# Altium schematic sheet 1gb_switch.SchDoc
size 594 x 420 mm; Address1: Address1; Address2: Address2; Address3: Address3; Address4: Address4; DocumentNumber: 3; SheetNumber: 3; SheetTotal: 6; Перв_применение: Э3
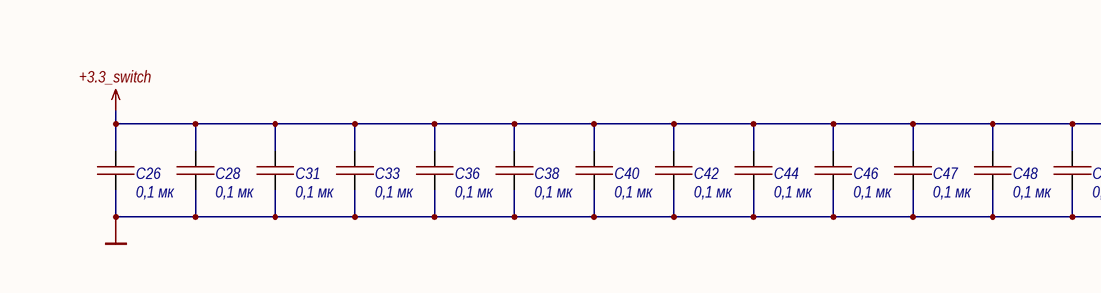
[diagram p0: 1gb_switch.SchDoc, top left]
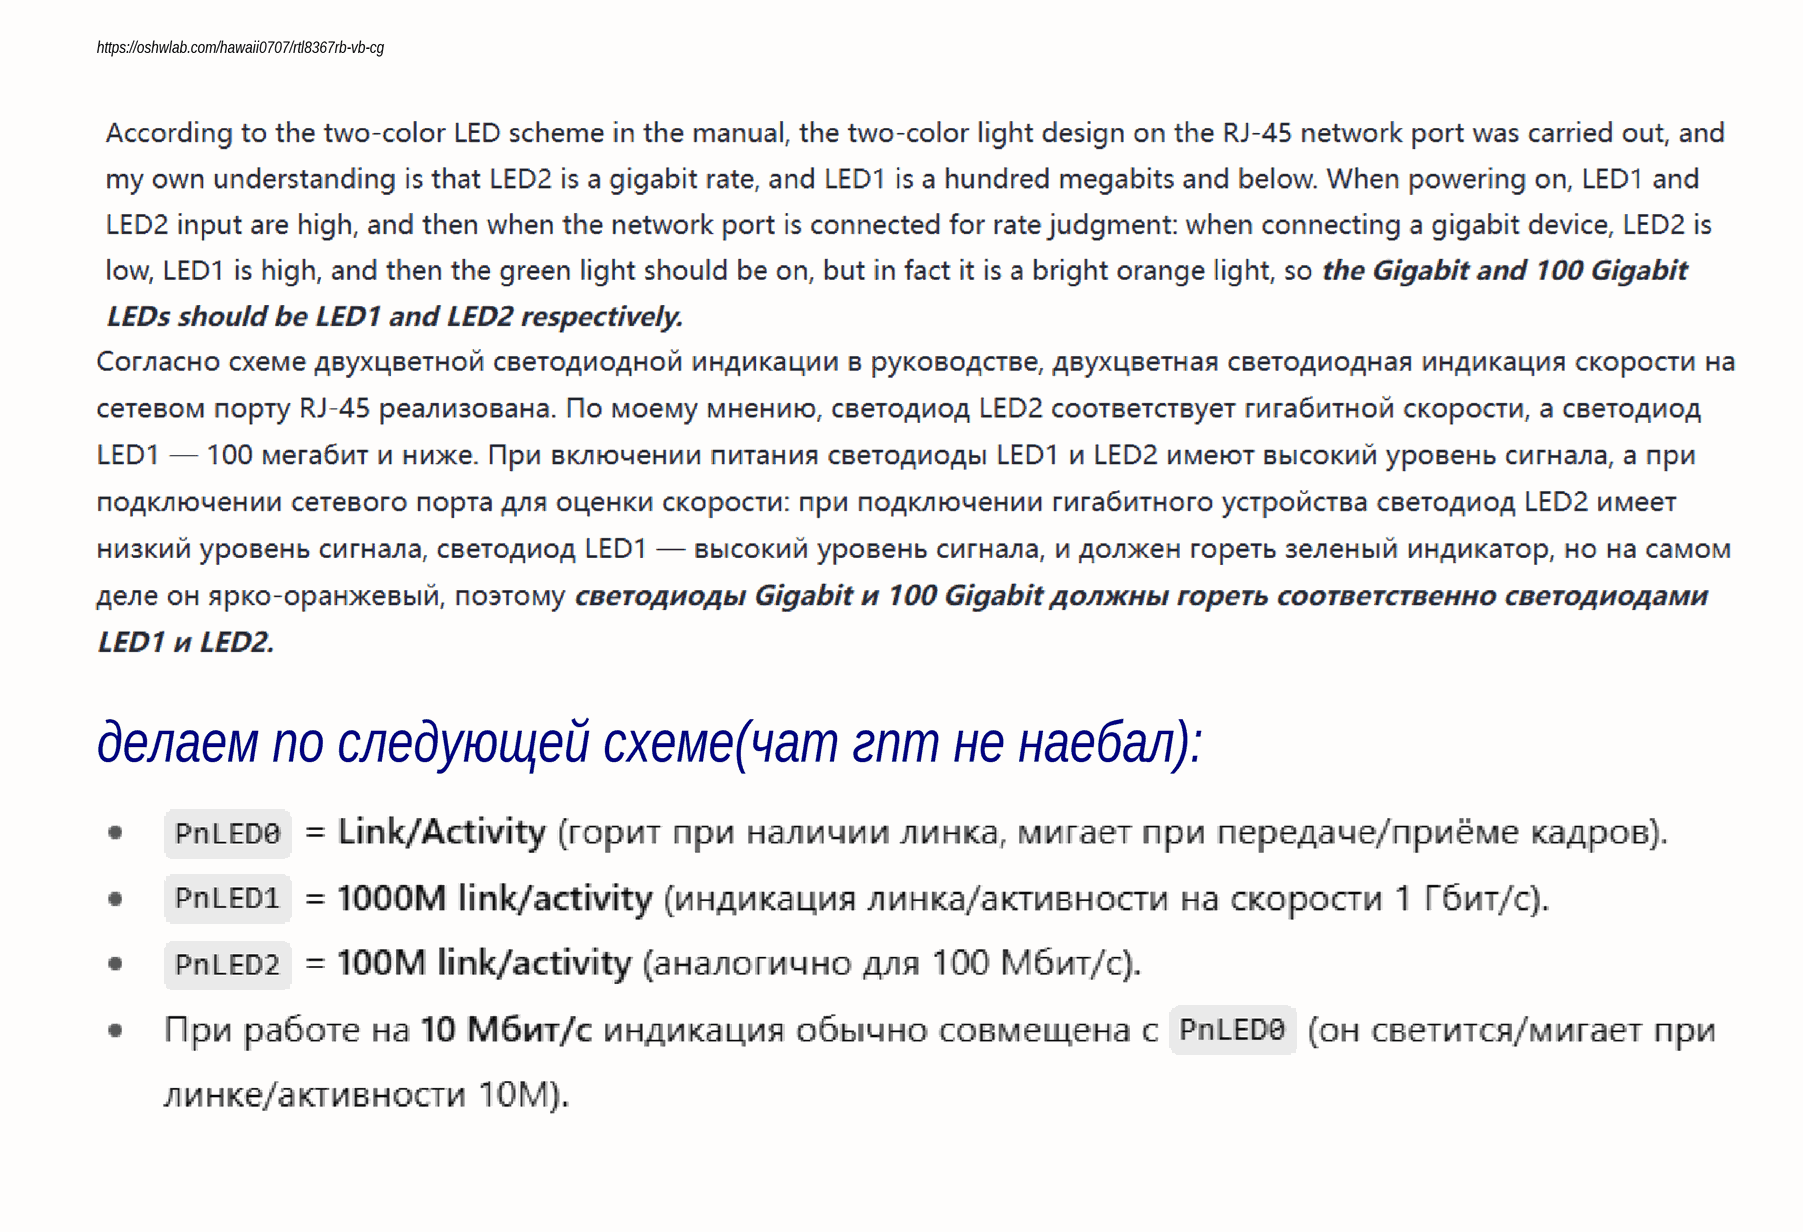
[diagram p1: 1gb_switch.SchDoc, top right]
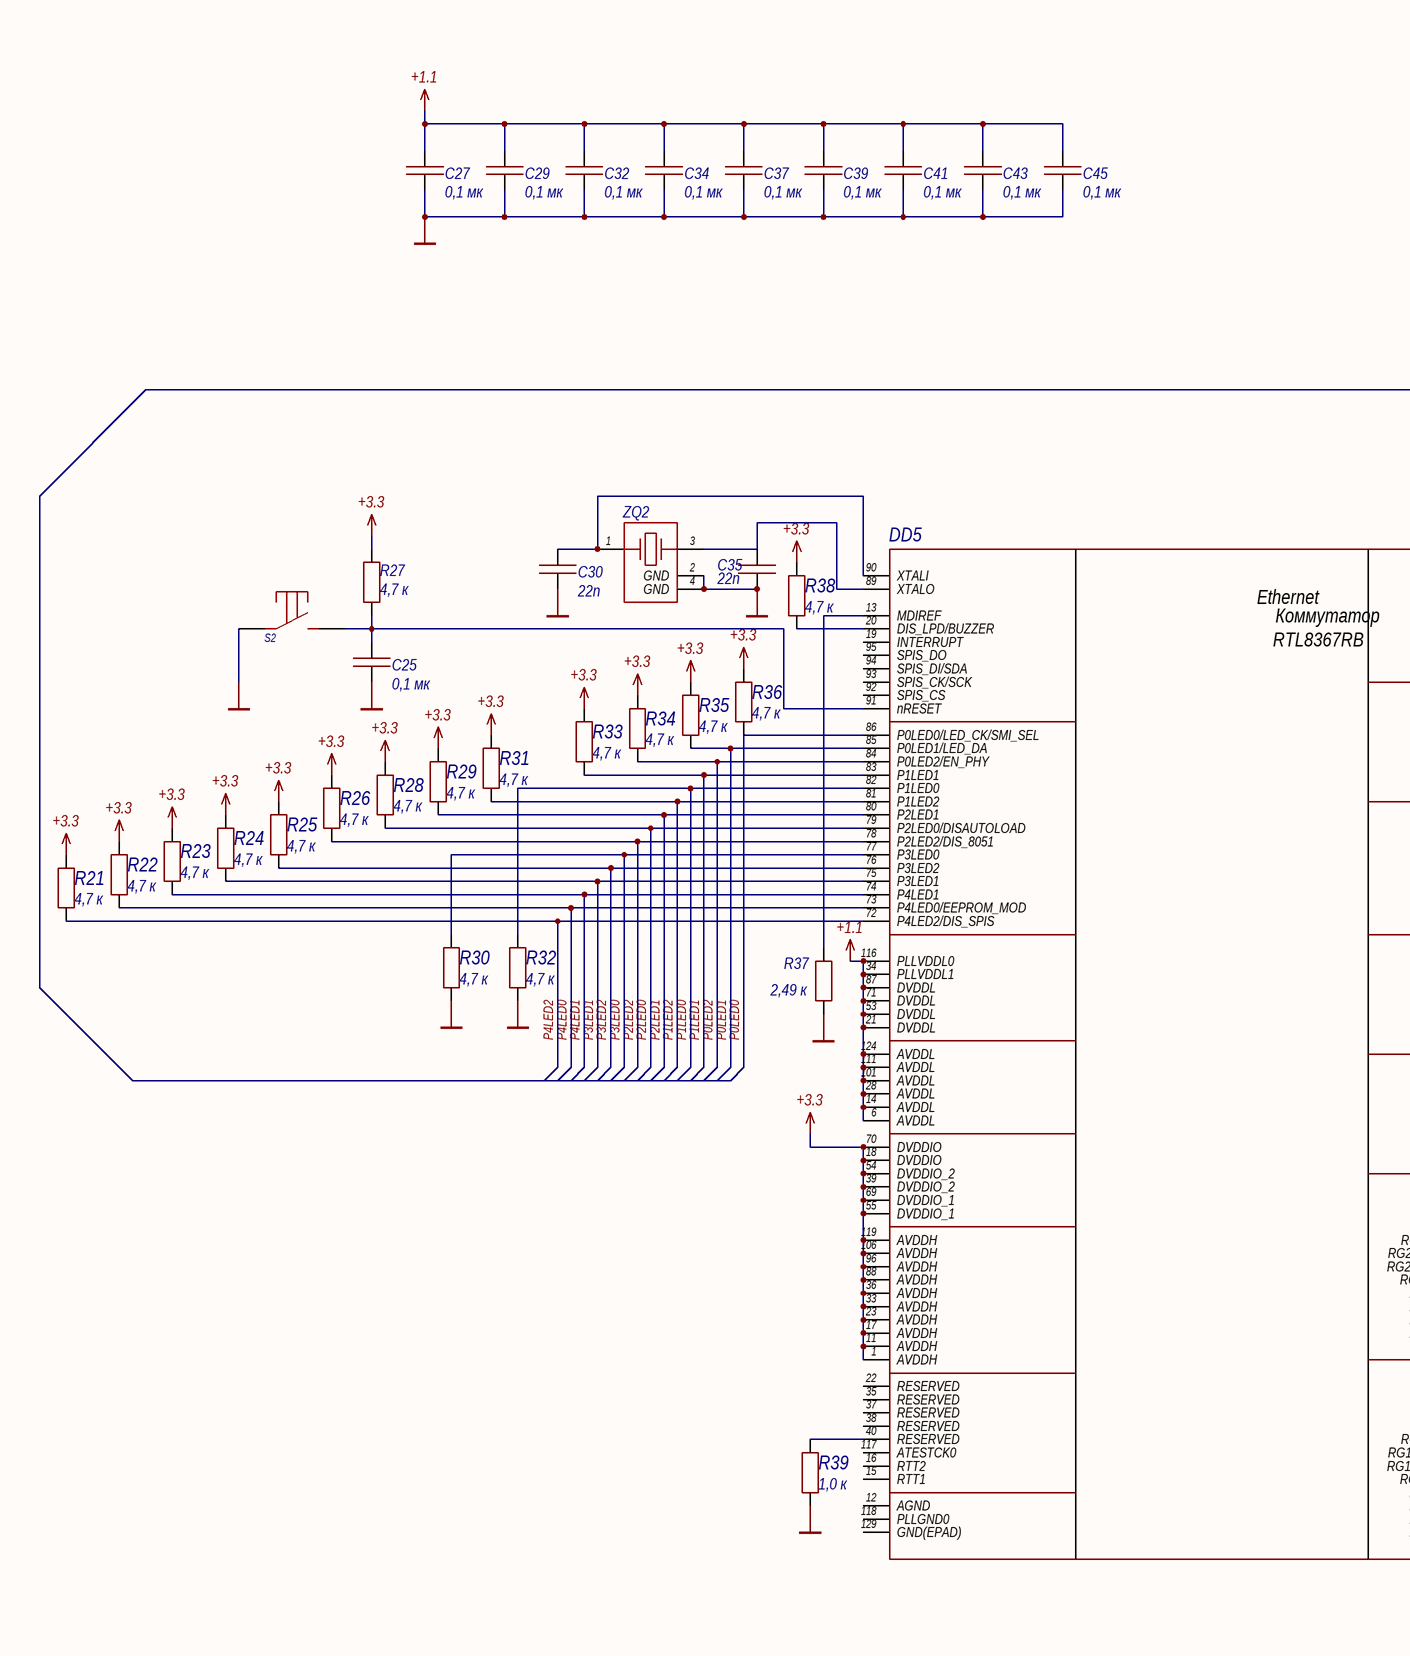
[diagram p2: 1gb_switch.SchDoc, bottom left]
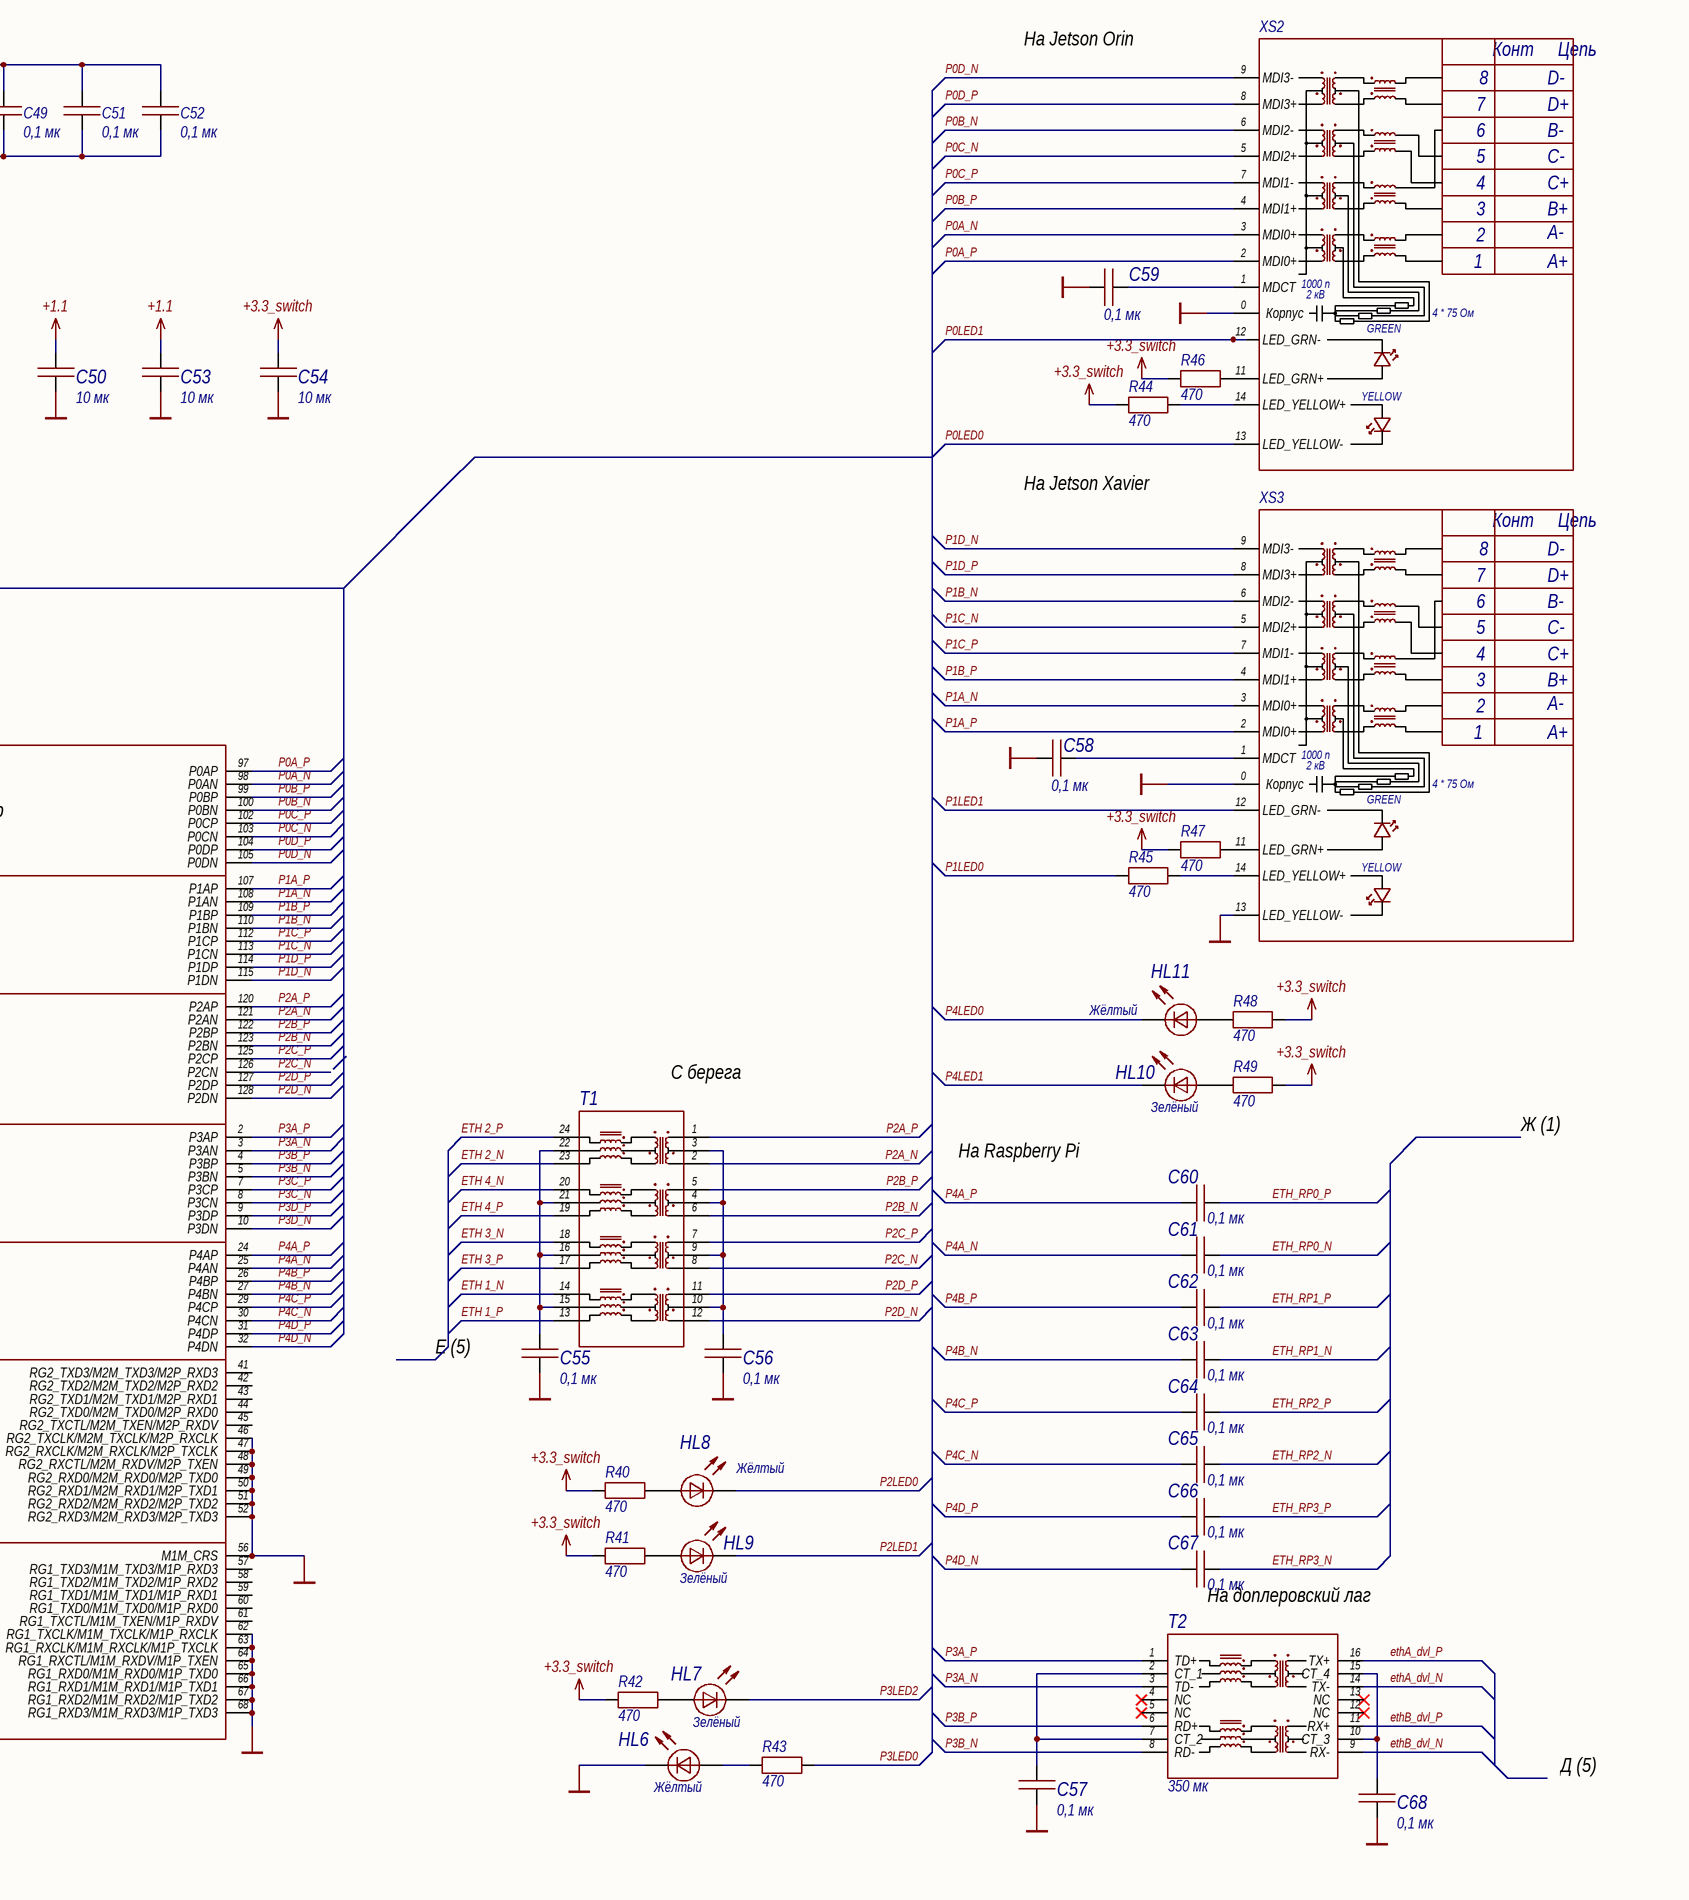
[diagram p3: 1gb_switch.SchDoc, bottom right]

## Parts
C25  value 0,1 мк  [0603C]  (hidden comment: Capacitor)
C26  value 0,1 мк  [0402C]  (hidden comment: Capacitor)
C27  value 0,1 мк  [0402C]  (hidden comment: Capacitor)
C28  value 0,1 мк  [0402C]  (hidden comment: Capacitor)
C29  value 0,1 мк  [0402C]  (hidden comment: Capacitor)
C30  value 22п  [0603C]  (hidden comment: GRM1885C1H220J)
C31  value 0,1 мк  [0402C]  (hidden comment: Capacitor)
C32  value 0,1 мк  [0402C]  (hidden comment: Capacitor)
C33  value 0,1 мк  [0402C]  (hidden comment: Capacitor)
C34  value 0,1 мк  [0402C]  (hidden comment: Capacitor)
C35  value 22п  [0603C]  (hidden comment: GRM1885C1H220J)
C36  value 0,1 мк  [0402C]  (hidden comment: Capacitor)
C37  value 0,1 мк  [0402C]  (hidden comment: Capacitor)
C38  value 0,1 мк  [0402C]  (hidden comment: Capacitor)
C39  value 0,1 мк  [0402C]  (hidden comment: Capacitor)
C40  value 0,1 мк  [0402C]  (hidden comment: Capacitor)
C41  value 0,1 мк  [0402C]  (hidden comment: Capacitor)
C42  value 0,1 мк  [0402C]  (hidden comment: Capacitor)
C43  value 0,1 мк  [0402C]  (hidden comment: Capacitor)
C44  value 0,1 мк  [0402C]  (hidden comment: Capacitor)
C45  value 0,1 мк  [0402C]  (hidden comment: Capacitor)
C46  value 0,1 мк  [0402C]  (hidden comment: Capacitor)
C47  value 0,1 мк  [0402C]  (hidden comment: Capacitor)
C48  value 0,1 мк  [0402C]  (hidden comment: Capacitor)
C49  value 0,1 мк  [0402C]  (hidden comment: Capacitor)
C50  value 10 мк  [1210C]  (hidden comment: Capacitor)
C51  value 0,1 мк  [0402C]  (hidden comment: Capacitor)
C52  value 0,1 мк  [0402C]  (hidden comment: Capacitor)
C53  value 10 мк  [1210C]  (hidden comment: Capacitor)
C54  value 10 мк  [1210C]  (hidden comment: Capacitor)
C55  value 0,1 мк  [0603C]  (hidden comment: Capacitor)
C56  value 0,1 мк  [0603C]  (hidden comment: Capacitor)
C57  value 0,1 мк  [0603C]  (hidden comment: Capacitor)
C58  value 0,1 мк  [0603C]  (hidden comment: Capacitor)
C59  value 0,1 мк  [0603C]  (hidden comment: Capacitor)
C60  value 0,1 мк  [0402C]  (hidden comment: Capacitor)
C61  value 0,1 мк  [0402C]  (hidden comment: Capacitor)
C62  value 0,1 мк  [0402C]  (hidden comment: Capacitor)
C63  value 0,1 мк  [0402C]  (hidden comment: Capacitor)
C64  value 0,1 мк  [0402C]  (hidden comment: Capacitor)
C65  value 0,1 мк  [0402C]  (hidden comment: Capacitor)
C66  value 0,1 мк  [0402C]  (hidden comment: Capacitor)
C67  value 0,1 мк  [0402C]  (hidden comment: Capacitor)
C68  value 0,1 мк  [0603C]  (hidden comment: Capacitor)
DD5  RTL8367RB-VB  [LQFP128_14x14_exposed_pad]  (value not drawn)
HL6  value Жёлтый  [0603D_yellow]  (hidden comment: LED 0603 YELLOW)
HL7  value Зелёный  [0603D_green]  (hidden comment: LED 0603 GREEN)
HL8  value Жёлтый  [0603D_yellow]  (hidden comment: LED 0603 YELLOW)
HL9  value Зелёный  [0603D_green]  (hidden comment: LED 0603 GREEN)
HL10  value Зелёный  [0603D_green]  (hidden comment: LED 0603 GREEN)
HL11  value Жёлтый  [0603D_yellow]  (hidden comment: LED 0603 YELLOW)
R21  value 4,7 к  [0402R]  (hidden comment: Resistor)
R22  value 4,7 к  [0402R]  (hidden comment: Resistor)
R23  value 4,7 к  [0402R]  (hidden comment: Resistor)
R24  value 4,7 к  [0402R]  (hidden comment: Resistor)
R25  value 4,7 к  [0402R]  (hidden comment: Resistor)
R26  value 4,7 к  [0402R]  (hidden comment: Resistor)
R27  value 4,7 к  [0402R]  (hidden comment: Resistor)
R28  value 4,7 к  [0402R]  (hidden comment: Resistor)
R29  value 4,7 к  [0402R]  (hidden comment: Resistor)
R30  value 4,7 к  [0402R]  (hidden comment: Resistor)
R31  value 4,7 к  [0402R]  (hidden comment: Resistor)
R32  value 4,7 к  [0402R]  (hidden comment: Resistor)
R33  value 4,7 к  [0402R]  (hidden comment: Resistor)
R34  value 4,7 к  [0402R]  (hidden comment: Resistor)
R35  value 4,7 к  [0402R]  (hidden comment: Resistor)
R36  value 4,7 к  [0402R]  (hidden comment: Resistor)
R37  value 2,49 к  [0603R]  (hidden comment: RC0603FR-072K49L)
R38  value 4,7 к  [0402R]  (hidden comment: Resistor)
R39  value 1,0 к  [0402R]  (hidden comment: Resistor)
R40  value 470  [0402R]  (hidden comment: Resistor)
R41  value 470  [0402R]  (hidden comment: Resistor)
R42  value 470  [0402R]  (hidden comment: Resistor)
R43  value 470  [0402R]  (hidden comment: Resistor)
R44  value 470  [0402R]  (hidden comment: Resistor)
R45  value 470  [0402R]  (hidden comment: Resistor)
R46  value 470  [0402R]  (hidden comment: Resistor)
R47  value 470  [0402R]  (hidden comment: Resistor)
R48  value 470  [0402R]  (hidden comment: Resistor)
R49  value 470  [0402R]  (hidden comment: Resistor)
S2  TSS-TD-19XA-XTR  [TSS-TD-19XA-XTR]  (value not drawn)
T1  H5120NLT  [H5120NLT]  (value not drawn)
T2  value 350 мк  [B78476A8065A003]  (hidden comment: B78476A8065A003)
XS2  HR911130A  [HR911130A]  (value not drawn)
XS3  HR911130A  [HR911130A]  (value not drawn)
ZQ2  X322525MOB4SI  [X322525MOB4SI]  (value not drawn)

## Nets
+1.1: C27.2 C29.2 C32.2 C34.2 C37.2 C39.2 C41.2 C43.2 C45.2 C50.2 C53.2 DD5.6(AVDDL) DD5.14(AVDDL) DD5.21(DVDDL) DD5.28(AVDDL) DD5.34(PLLVDDL1) DD5.53(DVDDL) DD5.71(DVDDL) DD5.87(DVDDL) DD5.101(AVDDL) DD5.111(AVDDL) DD5.116(PLLVDDL0) DD5.124(AVDDL)
+3.3: DD5.1(AVDDH) DD5.11(AVDDH) DD5.17(AVDDH) DD5.18(DVDDIO) DD5.23(AVDDH) DD5.33(AVDDH) DD5.36(AVDDH) DD5.39(DVDDIO_2) DD5.54(DVDDIO_2) DD5.55(DVDDIO_1) DD5.69(DVDDIO_1) DD5.70(DVDDIO) DD5.88(AVDDH) DD5.96(AVDDH) DD5.106(AVDDH) DD5.119(AVDDH) R21.2 R22.2 R23.2 R24.2 R25.2 R26.2 R27.2 R28.2 R29.2 R31.2 R33.2 R34.2 R35.2 R36.2 R38.2
+3.3_switch: C26.2 C28.2 C31.2 C33.2 C36.2 C38.2 C40.2 C42.2 C44.2 C46.2 C47.2 C48.2 C49.2 C51.2 C52.2 C54.2 R40.1 R41.1 R42.1 R44.1 R46.1 R47.1 R48.1 R49.1
GND: C25.1 C26.1 C27.1 C28.1 C29.1 C30.1 C31.1 C32.1 C33.1 C34.1 C35.2 C36.1 C37.1 C38.1 C39.1 C40.1 C41.1 C42.1 C43.1 C44.1 C45.1 C46.1 C47.1 C48.1 C49.1 C50.1 C51.1 C52.1 C53.1 C54.1 C55.1 C56.1 C57.1 C58.1 C59.1 C68.1 DD5.46(RG2_TXCLK/M2M_TXCLK/M2P_RXCLK) DD5.47(RG2_RXCLK/M2M_RXCLK/M2P_TXCLK) DD5.48(RG2_RXCTL/M2M_RXDV/M2P_TXEN) DD5.49(RG2_RXD0/M2M_RXD0/M2P_TXD0) DD5.50(RG2_RXD1/M2M_RXD1/M2P_TXD1) DD5.51(RG2_RXD2/M2M_RXD2/M2P_TXD2) DD5.52(RG2_RXD3/M2M_RXD3/M2P_TXD3) DD5.56(M1M_CRS) DD5.62(RG1_TXCLK/M1M_TXCLK/M1P_RXCLK) DD5.63(RG1_RXCLK/M1M_RXCLK/M1P_TXCLK) DD5.64(RG1_RXCTL/M1M_RXDV/M1P_TXEN) DD5.65(RG1_RXD0/M1M_RXD0/M1P_TXD0) DD5.66(RG1_RXD1/M1M_RXD1/M1P_TXD1) DD5.67(RG1_RXD2/M1M_RXD2/M1P_TXD2) DD5.68(RG1_RXD3/M1M_RXD3/M1P_TXD3) HL6.2 R30.1 R32.1 R37.1 R39.1 S2.1 XS2.0(Корпус) XS3.0(Корпус) XS3.13(LED_YELLOW-) ZQ2.2(GND) ZQ2.4(GND)
ETH 1_N: T1.14
ETH 1_P: T1.13
ETH 2_N: T1.23
ETH 2_P: T1.24
ETH 3_N: T1.18
ETH 3_P: T1.17
ETH 4_N: T1.20
ETH 4_P: T1.19
ETH_RP0_N: C61.2
ETH_RP0_P: C60.2
ETH_RP1_N: C63.2
ETH_RP1_P: C62.2
ETH_RP2_N: C65.2
ETH_RP2_P: C64.2
ETH_RP3_N: C67.2
ETH_RP3_P: C66.2
ethA_dvl_N: T2.14(TX-)
ethA_dvl_P: T2.16(TX+)
ethB_dvl_N: T2.9(RX-)
ethB_dvl_P: T2.11(RX+)
P0A_N: DD5.98(P0AN) XS2.3(MDI0+)
P0A_P: DD5.97(P0AP) XS2.2(MDI0+)
P0B_N: DD5.100(P0BN) XS2.6(MDI2-)
P0B_P: DD5.99(P0BP) XS2.4(MDI1+)
P0C_N: DD5.103(P0CN) XS2.5(MDI2+)
P0C_P: DD5.102(P0CP) XS2.7(MDI1-)
P0D_N: DD5.105(P0DN) XS2.9(MDI3-)
P0D_P: DD5.104(P0DP) XS2.8(MDI3+)
P0LED0: DD5.86(P0LED0/LED_CK/SMI_SEL) R36.1 XS2.13(LED_YELLOW-)
P0LED1: DD5.85(P0LED1/LED_DA) R35.1 XS2.12(LED_GRN-)
P0LED2: DD5.84(P0LED2/EN_PHY) R34.1
P1A_N: DD5.108(P1AN) XS3.3(MDI0+)
P1A_P: DD5.107(P1AP) XS3.2(MDI0+)
P1B_N: DD5.110(P1BN) XS3.6(MDI2-)
P1B_P: DD5.109(P1BP) XS3.4(MDI1+)
P1C_N: DD5.113(P1CN) XS3.5(MDI2+)
P1C_P: DD5.112(P1CP) XS3.7(MDI1-)
P1D_N: DD5.115(P1DN) XS3.9(MDI3-)
P1D_P: DD5.114(P1DP) XS3.8(MDI3+)
P1LED0: DD5.82(P1LED0) R32.2 R45.1
P1LED1: DD5.83(P1LED1) R33.1 XS3.12(LED_GRN-)
P1LED2: DD5.81(P1LED2) R31.1
P2A_N: DD5.121(P2AN) T1.2
P2A_P: DD5.120(P2AP) T1.1
P2B_N: DD5.123(P2BN) T1.6
P2B_P: DD5.122(P2BP) T1.5
P2C_N: DD5.126(P2CN) T1.8
P2C_P: DD5.125(P2CP) T1.7
P2D_N: DD5.128(P2DN) T1.12
P2D_P: DD5.127(P2DP) T1.11
P2LED0: DD5.79(P2LED0/DISAUTOLOAD) HL8.2 R28.1
P2LED1: DD5.80(P2LED1) HL9.2 R29.1
P2LED2: DD5.78(P2LED2/DIS_8051) R26.1
P3A_N: DD5.3(P3AN) T2.3(TD-)
P3A_P: DD5.2(P3AP) T2.1(TD+)
P3B_N: DD5.5(P3BN) T2.8(RD-)
P3B_P: DD5.4(P3BP) T2.6(RD+)
P3C_N: DD5.8(P3CN)
P3C_P: DD5.7(P3CP)
P3D_N: DD5.10(P3DN)
P3D_P: DD5.9(P3DP)
P3LED0: DD5.77(P3LED0) R30.2 R43.1
P3LED1: DD5.75(P3LED1) R24.1
P3LED2: DD5.76(P3LED2) HL7.2 R25.1
P4A_N: C61.1 DD5.25(P4AN)
P4A_P: C60.1 DD5.24(P4AP)
P4B_N: C63.1 DD5.27(P4BN)
P4B_P: C62.1 DD5.26(P4BP)
P4C_N: C65.1 DD5.30(P4CN)
P4C_P: C64.1 DD5.29(P4CP)
P4D_N: C67.1 DD5.32(P4DN)
P4D_P: C66.1 DD5.31(P4DP)
P4LED0: DD5.73(P4LED0/EEPROM_MOD) HL11.2 R22.1
P4LED1: DD5.74(P4LED1) HL10.2 R23.1
P4LED2: DD5.72(P4LED2/DIS_SPIS) R21.1
NetC25_2: C25.2 DD5.91(nRESET) R27.1 S2.2
NetC30_2: C30.2 DD5.90(XTALI) ZQ2.1
NetC35_1: C35.1 DD5.89(XTALO) ZQ2.3
NetC55_2: C55.2 T1.15 T1.16 T1.21 T1.22
NetC56_2: C56.2 T1.3 T1.4 T1.9 T1.10
NetC57_2: C57.2 T2.2(CT_1) T2.7(CT_2)
NetC58_2: C58.2 XS3.1(MDCT)
NetC59_2: C59.2 XS2.1(MDCT)
NetC68_2: C68.2 T2.10(CT_3) T2.15(CT_4)
NetDD5_13: DD5.13(MDIREF) R37.2
NetDD5_20: DD5.20(DIS_LPD/BUZZER) R38.1
NetDD5_40: DD5.40(RESERVED) R39.2
NetHL6_1: HL6.1 R43.2
NetHL7_1: HL7.1 R42.2
NetHL8_1: HL8.1 R40.2
NetHL9_1: HL9.1 R41.2
NetHL10_1: HL10.1 R49.2
NetHL11_1: HL11.1 R48.2
NetR44_2: R44.2 XS2.14(LED_YELLOW+)
NetR45_2: R45.2 XS3.14(LED_YELLOW+)
NetR46_2: R46.2 XS2.11(LED_GRN+)
NetR47_2: R47.2 XS3.11(LED_GRN+)

Not connected (* = marked no-connect by the designer): DD5 12(AGND) 15(RTT1) 16(RTT2) 19(INTERRUPT) 22(RESERVED) 35(RESERVED) 37(RESERVED) 38(RESERVED) 41(RG2_TXD3/M2M_TXD3/M2P_RXD3) 42(RG2_TXD2/M2M_TXD2/M2P_RXD2) 43(RG2_TXD1/M2M_TXD1/M2P_RXD1) 44(RG2_TXD0/M2M_TXD0/M2P_RXD0) 45(RG2_TXCTL/M2M_TXEN/M2P_RXDV) 57(RG1_TXD3/M1M_TXD3/M1P_RXD3) 58(RG1_TXD2/M1M_TXD2/M1P_RXD2) 59(RG1_TXD1/M1M_TXD1/M1P_RXD1) 60(RG1_TXD0/M1M_TXD0/M1P_RXD0) 61(RG1_TXCTL/M1M_TXEN/M1P_RXDV) 92(SPIS_CS) 93(SPIS_CK/SCK) 94(SPIS_DI/SDA) 95(SPIS_DO) 117(ATESTCK0) 118(PLLGND0) 129(GND(EPAD)); T2 4(NC)* 5(NC)* 12(NC)* 13(NC)*

## Notes on the sheet
- https://oshwlab.com/hawaii0707/rtl8367rb-vb-cg
- делаем по следующей схеме(чат гпт не наебал):
- На Jetson Orin
- На Jetson Xavier
- (near T1) С берега
- На Raspberry Pi
- Ж (1)
- Е (5)
- (near C67) На доплеровский лаг
- Д (5)
- Перв. примен.
- Справ. №
- Подп. и дата
- Инв. № дубл.
- Взам. инв. №
- Инв. № подл.
- Изм.
- Лист
- № докум.
- Подп.
- Дата
- Копировал
- Формат А2
- (in symbol HR911130A) Конт; Цепь; D-; D+; B-; C-; C+; B+; A-; A+; 1000 п; 2 кВ; 4 * 75 Ом; GREEN; YELLOW
- (in symbol RTL8367RB-VB) Ethernet; Коммутатор; RTL8367RB

## Library data of the parts
C25 C55-C59 C68 = Capacitor_0,1u_10_50V_X7R_0603C: Конденсатор 0603C ёмкостью 0,1 мк 10%, 50 В, X7R; Voltage (V): 50; Capacity (nF): 100; Part Number: Capacitor_0,1u_10_50V_X7R_0603C; Tolerance: 10%; Dielectric: X7R
C26-C29 C31-C34 C36-C49 C51 C52 C60-C67 = Capacitor_0,1u_10_16V_X7R_0603C: Конденсатор 0402C ёмкостью 0,1 мк 10%, 16 В, X7R; Voltage (V): 16; Capacity (nF): 100; Автор: rreali; Part Number: Capacitor_0,1u_10_16V_X7R_0603C; Tolerance: 10%; Dielectric: X7R
C30 C35 = GRM1885C1H220J: Конденсатор 0603C ёмкостью 22п 5%, 50 В, NP0; Voltage (V): 50; Capacity (nF): 0,022; Автор: rreali; Datasheet: https://cdn.promelec.ru/upload/items/2020/02/18/MURATA_MLCC_catalog_C02E_short_.pdf; Part Number: GRM1885C1H220J; Tolerance: 5%; Dielectric: NP0
C50 C53 C54 = Capacitor_10u_10_35V_X7R_1210C: Конденсатор 1210C ёмкостью 10 мк 10%, 35 В, X7R; Voltage (V): 35; Capacity (nF): 10000; Part Number: Capacitor_10u_10_35V_X7R_1210C; Tolerance: 10%; Dielectric: X7R
DD5 = RTL8367RB-VB: Управляемый коммутатор второго уровня на 5+2 порта 10/100/1000M; Автор: rreali; Part Number: RTL8367RB-VB; Datasheet: https://static.chipdip.ru/lib/518/DOC041518607.pdf
HL6 HL8 HL11 = LED 0603 YELLOW: Светодиод 0603 Жёлтый; Автор: rreali; Part Number: LED 0603 YELLOW
HL7 HL9 HL10 = LED 0603 GREEN: Светодиод 0603 Зелёный; Автор: rreali; Part Number: LED 0603 GREEN
R21-R36 R38 = Resistor_4.7k_1_0402: Резистор номиналом 4,7 кОм 1%; Автор: rreali; Power: *; Part Number: Resistor_4.7k_1_0402; Tolerance: 1%
R37 = RC0603FR-072K49L: 0.1Вт 0603 2.49 кОм, 1%, Чип резистор; Автор: rreali; Power: *; Part Number: RC0603FR-072K49L; Tolerance: 1%
R39 = Resistor_1.0k_1_0402: Резистор номиналом 1,0 кОм 1%; Автор: rreali; Power: *; Part Number: Resistor_1.0k_1_0402; Tolerance: 1%
R40-R49 = Resistor_470_1_0402: Резистор номиналом 470 Ом 1%; Автор: rreali; Power: *; Part Number: Resistor_470_1_0402; Tolerance: 1%
S2 = TSS-TD-19XA-XTR: Тактовая кнопка; Автор: glebmih; Part Number: TSS-TD-19XA-XTR; Datasheet: https://cdn.promelec.ru/upload/items/2023/04/17/TSS-TD-19XA.pdf
T1 = H5120NLT: Телекоммуникационный трансформатор 10/100/1000 Base-T, 1CT:1CT, изоляция 1500В; Value: 350 мк; Inductance (μH): 0; Current: 0,0 А; Автор: rreali; Part Number: H5120NLT; Datasheet: cdn.promelec.ru/upload/items/2024/01/29/H5120NL_.pdf
T2 = B78476A8065A003: Телекоммуникационный трансформатор, 10/100Base-T 1CT:1CT, 16 выводов, 12.7x6.9x5.6mm; Manufacturer_Name: TDK; Geometry.Height: 5.85mm; Inductance (μH): 0; Current: 0,0 А; Автор: rreali; Manufacturer_Part_Number: B78476A8065A003; Mouser Part Number: 871-B78476A8065A3; Mouser Price/Stock: https://www.mouser.co.uk/ProductDetail/EPCOS-TDK/B78476A8065A003?qs=Uha62PnlbFBmivqA6S0Irg%3D%3D; Arrow Part Number: B78476A8065A003; Arrow Price/Stock: https://www.arrow.com/en/products/b78476a8065a003/epcos-tdk; Datasheet Link: https://product.tdk.com/system/files/dam/doc/product/transformer/transformer/lan/data_sheet/30/ds/lan_mod/b78476a8065a003.pdf; Part Number: B78476A8065A003; Datasheet: https://cdn.promelec.ru/upload/datasheet/8/0/B78476A8065A003.pdf
XS2 XS3 = HR911130A: Однопортовый магнитный разъем RJ45 100/1000Base-T со встроенным трансформатором и светодиодами; System: Connector; Автор: rreali; Part Number: HR911130A; Datasheet: https://cdn.promelec.ru/upload/items/2023/08/23/HR911130A_.pdf
ZQ2 = X322525MOB4SI: Кварцевый резонатор SMD 25 МГц ±10ppm SMD-3225_4P; Value: 25 МГц; Автор: rreali; Part Number: X322525MOB4SI; Datasheet: https://datasheet.lcsc.com/lcsc/Yangxing-Tech-X322525MOB4SI_C9006.pdf